# EAGLE design DIY_tool_-_Arduino_nano_shield_v1.1 (EAGLE 8.0.0)
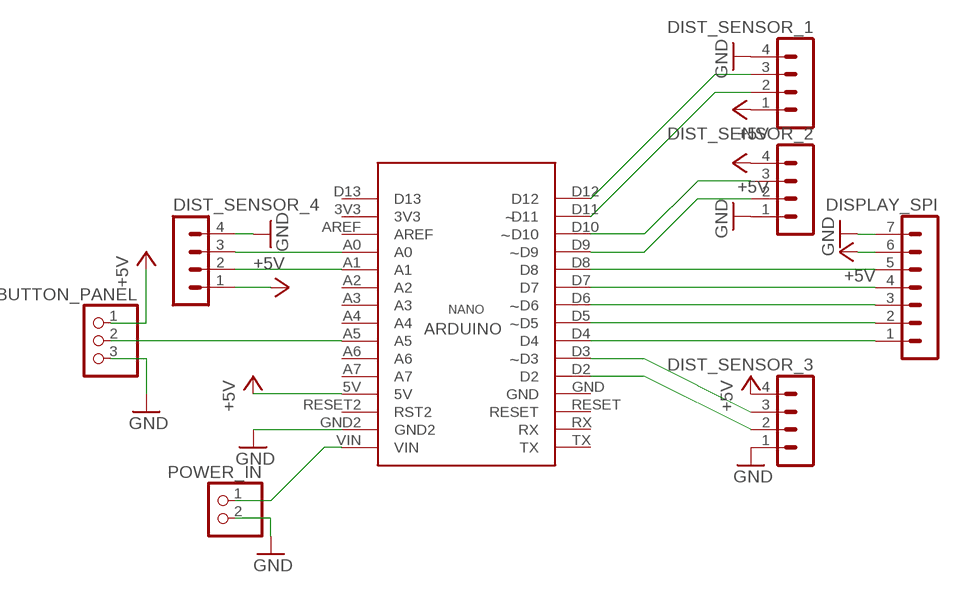
[diagram p0: schematic, sheet 1]

## Parts
BUTTON_PANEL  PINHD-1X3  [1X03]
DISPLAY_SPI  MA07-1  [MA07-1]
DIST_SENSOR_1  MA04-1  [MA04-1]
DIST_SENSOR_2  MA04-1  [MA04-1]
DIST_SENSOR_3  MA04-1  [MA04-1]
DIST_SENSOR_4  MA04-1  [MA04-1]
POWER_IN  PINHD-1X2  [1X02]
U$2  NANO  [NANO]

## Nets
+5V: BUTTON_PANEL.1 DISPLAY_SPI.6 DIST_SENSOR_1.1 DIST_SENSOR_2.4 DIST_SENSOR_3.4 DIST_SENSOR_4.1 U$2.5V
BTN_IN: BUTTON_PANEL.2 U$2.A5
GND: BUTTON_PANEL.3 DISPLAY_SPI.7 DIST_SENSOR_1.4 DIST_SENSOR_2.1 DIST_SENSOR_3.1 DIST_SENSOR_4.4 POWER_IN.2 U$2.GND2
OLED_CS: DISPLAY_SPI.1 U$2.D4
OLED_D0: DISPLAY_SPI.5 U$2.D8
OLED_D1: DISPLAY_SPI.4 U$2.D7
OLED_DC: DISPLAY_SPI.2 U$2.D5
OLED_RST: DISPLAY_SPI.3 U$2.D6
POWER_IN: POWER_IN.1 U$2.VIN
SENSOR_1_A: DIST_SENSOR_1.3 U$2.D12
SENSOR_1_B: DIST_SENSOR_1.2 U$2.D11
SENSOR_2_A: DIST_SENSOR_2.3 U$2.D10
SENSOR_2_B: DIST_SENSOR_2.2 U$2.D9
SENSOR_3_A: DIST_SENSOR_3.3 U$2.D3
SENSOR_3_B: DIST_SENSOR_3.2 U$2.D2
SENSOR_4_A: DIST_SENSOR_4.3 U$2.A0
SENSOR_4_B: DIST_SENSOR_4.2 U$2.A1
Unconnected: U$2.3V3 U$2.A2 U$2.A3 U$2.A4 U$2.A6 U$2.A7 U$2.AREF U$2.D13 U$2.GND U$2.RESET U$2.RESET2(RST2) U$2.RX U$2.TX

## Library data of the parts
BUTTON_PANEL = pinhead:PINHD-1X3: PIN HEADER
DISPLAY_SPI = con-lstb:MA07-1: PIN HEADER; OC_FARNELL: unknown; OC_NEWARK: unknown
DIST_SENSOR_1-DIST_SENSOR_4 = con-lstb:MA04-1: PIN HEADER; OC_FARNELL: unknown; OC_NEWARK: unknown
POWER_IN = pinhead:PINHD-1X2: PIN HEADER
U$2 = NANO:NANO

## Board
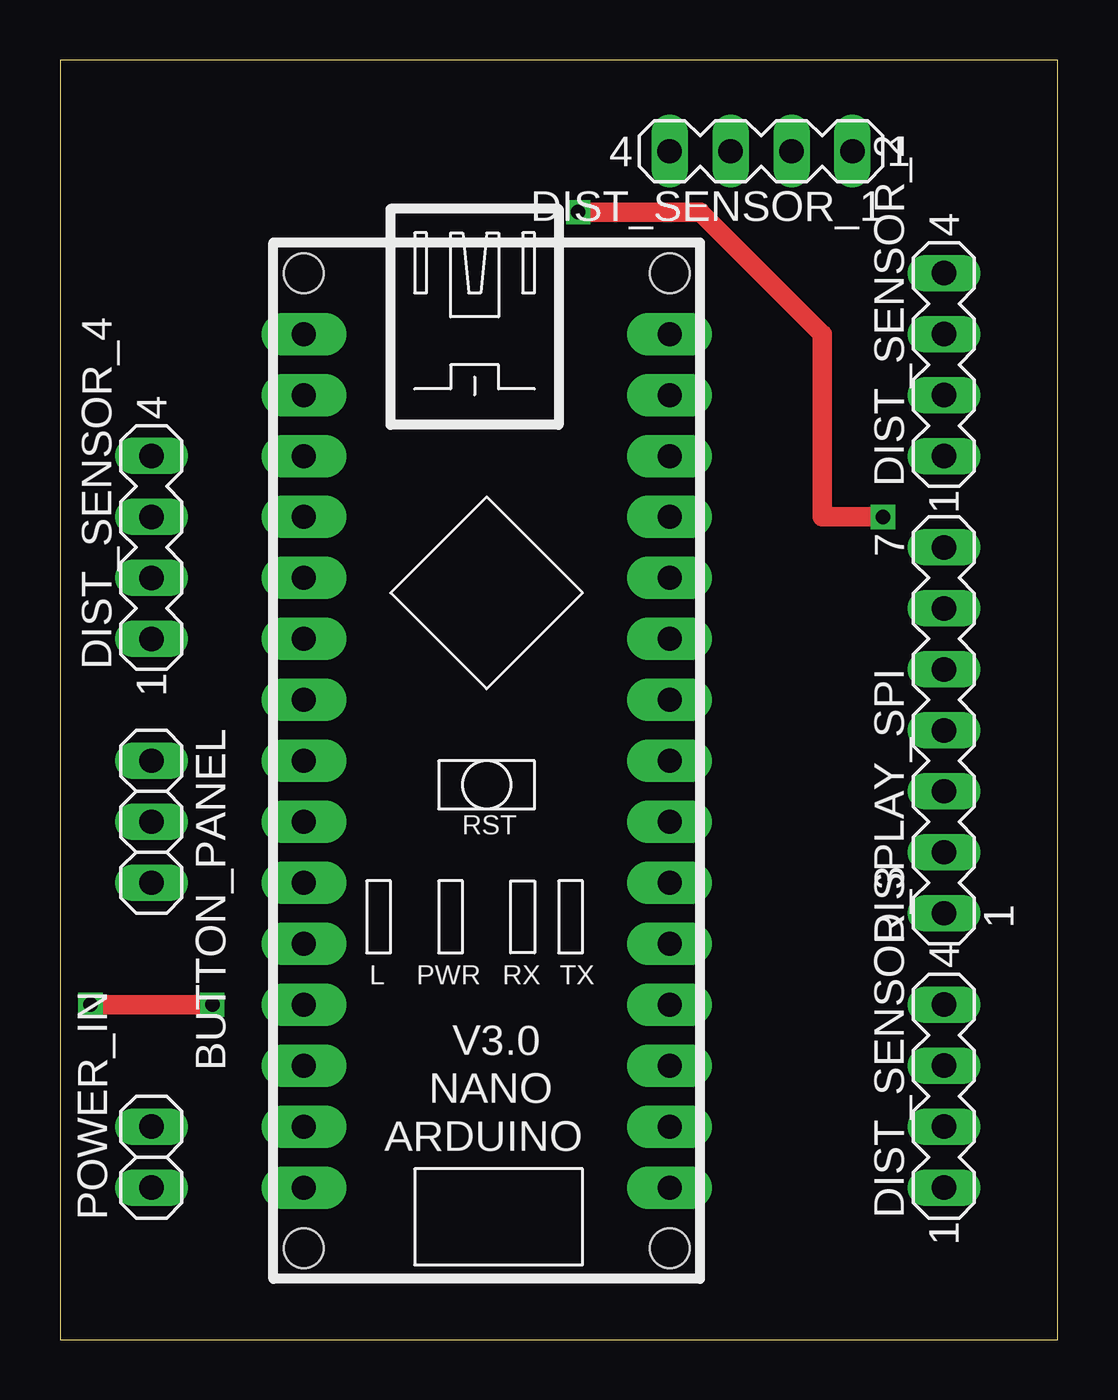
[diagram p1: board, top side]
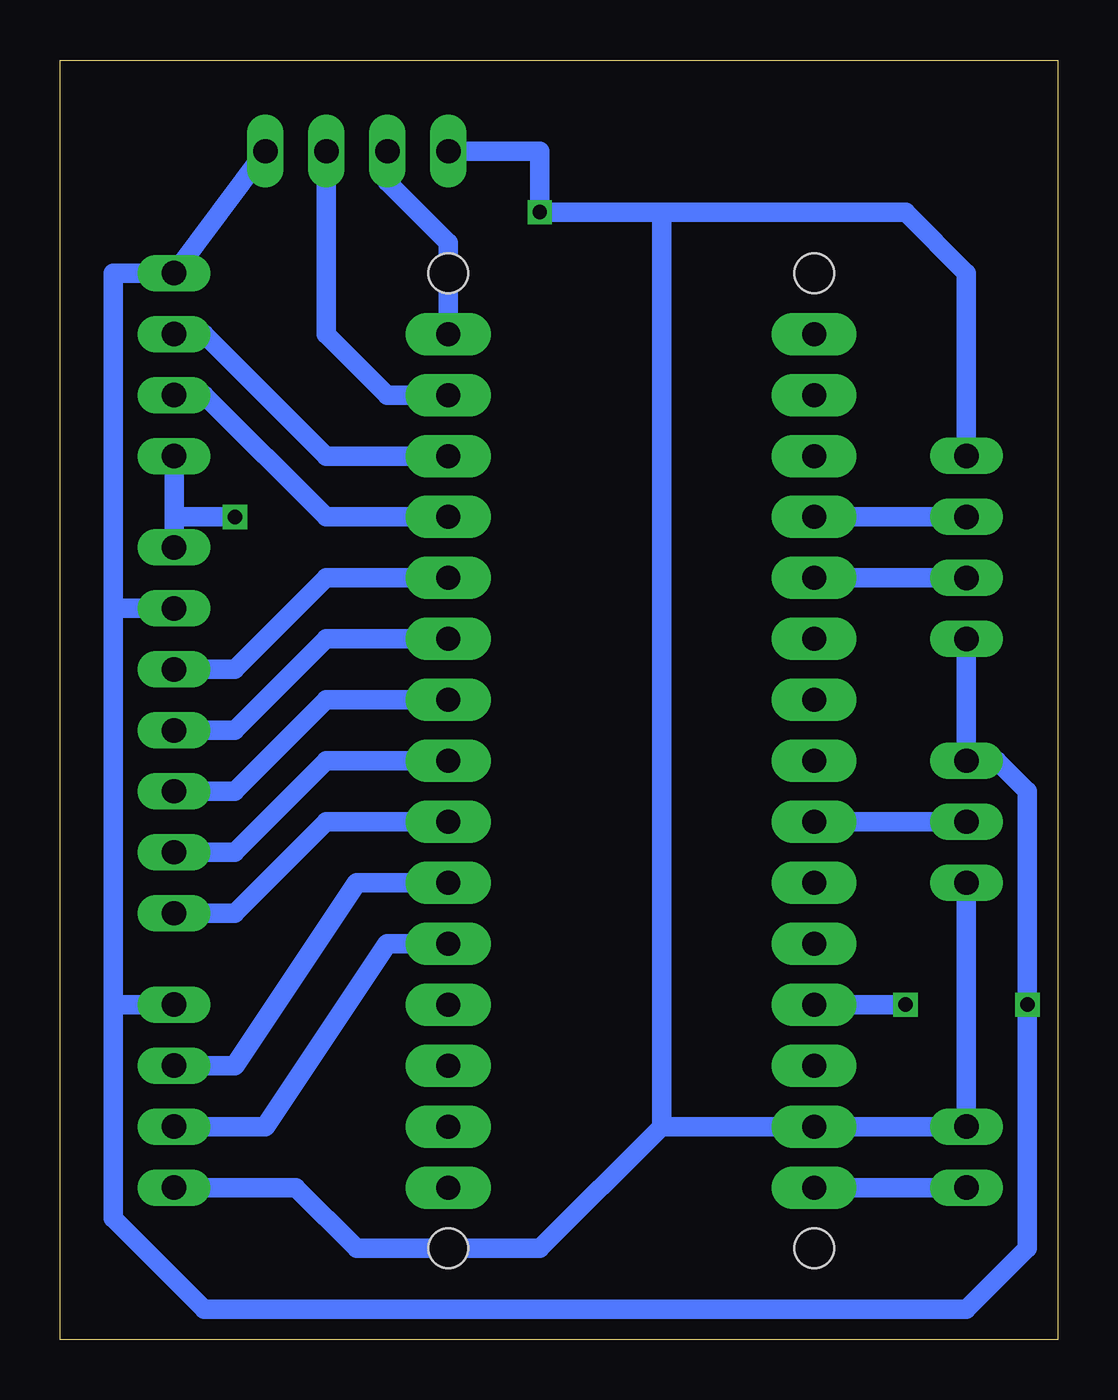
[diagram p2: board, bottom side, seen from below]

Size 41.58 x 53.33 mm. Coordinates in mm from the lower left corner, seen from the top.
Outline: 0,0 41.58,0 41.58,53.33 0,53.33 0,0
Copper layers (1*16): Top 0.035mm / dielectric 1.5mm / Bottom 0.035mm
Design rules "default": minimum track width 10mil, minimum drill 24mil, track to track 8mil, track to pad 8mil, pad to pad 8mil, via to via 8mil, smd to smd 8mil, copper to edge 40mil, drill to drill 8mil, minimum pad ring 10mil, minimum via ring 8mil, stop-mask expansion 4mil, vias tented up to drill 0mil, thermal gap 10mil

### Footprints (pad centres in the part's own frame; a part is rotated, then mirrored left to right if it is on the bottom)
1X03 = drill 1.016 long: 1 -2.54,0; 2 0,0; 3 2.54,0
MA07-1 = drill 1.016 long: 1 -7.62,0; 2 -5.08,0; 3 -2.54,0; 4 0,0; 5 2.54,0; 6 5.08,0; 7 7.62,0
MA04-1 = drill 1.016 long: 1 -3.81,0; 2 -1.27,0; 3 1.27,0; 4 3.81,0
1X02 = drill 1.016 long: 1 -1.27,0; 2 1.27,0
NANO = drill 1 pad 1.778 long: 3V3 7.62,-15.24; 5V 7.62,10.16; A0 7.62,-10.16; A1 7.62,-7.62; A2 7.62,-5.08; A3 7.62,-2.54; A4 7.62,0; A5 7.62,2.54; A6 7.62,5.08; A7 7.62,7.62; AREF 7.62,-12.7; D2 -7.62,7.62; D3 -7.62,5.08; D4 -7.62,2.54; D5 -7.62,0; D6 -7.62,-2.54; D7 -7.62,-5.08; D8 -7.62,-7.62; D9 -7.62,-10.16; D10 -7.62,-12.7; D11 -7.62,-15.24; D12 -7.62,-17.78; D13 7.62,-17.78; GND -7.62,10.16; GND2 7.62,15.24; RESET -7.62,12.7; RESET2 7.62,12.7; RX -7.62,15.24; TX -7.62,17.78; VIN 7.62,17.78 | hole 1.651: -7.62,-20.32; 7.62,-20.32; -7.62,20.32; 7.62,20.32

### Placement (x,y rotation side)
BUTTON_PANEL  3.81,21.59 270 top
DISPLAY_SPI  36.83,25.4 90 top
DIST_SENSOR_1  29.21,49.53 180 top
DIST_SENSOR_2  36.83,40.64 90 top
DIST_SENSOR_3  36.83,10.16 90 top
DIST_SENSOR_4  3.81,33.02 90 top
POWER_IN  3.81,7.62 90 top
U$2  17.78,24.13 180 top

### Tracks (layer width: path | path; a pad name or v marks a point on that pad's centre or on a via)
+5V  (via drill 0.6)
  Top 0.813: v6.35,13.97 v1.27,13.97
  Bottom 0.813: U$2.5V v6.35,13.97 | DIST_SENSOR_1.1 DIST_SENSOR_2.4 39.37,44.45 39.37,30.48 | DISPLAY_SPI.6 39.37,30.48 | DIST_SENSOR_4.1 BUTTON_PANEL.1 2.54,24.13 1.27,22.86 v1.27,13.97 1.27,3.81 3.81,1.27 35.56,1.27 39.37,5.08 39.37,13.97 | 39.37,30.48 39.37,13.97 | 39.37,13.97 DIST_SENSOR_3.4
BTN_IN
  Bottom 0.813: BUTTON_PANEL.2 U$2.A5
GND  (via drill 0.6)
  Top 0.813: v21.59,46.99 26.67,46.99 31.75,41.91 31.75,34.29 v34.29,34.29
  Bottom 0.813: BUTTON_PANEL.3 POWER_IN.2 U$2.GND2 16.51,8.89 | DISPLAY_SPI.7 36.83,34.29 | DIST_SENSOR_2.1 36.83,34.29 | 36.83,34.29 v34.29,34.29 | DIST_SENSOR_1.4 21.59,49.53 v21.59,46.99 16.51,46.99 | DIST_SENSOR_4.4 3.81,44.45 6.35,46.99 16.51,46.99 | DIST_SENSOR_3.1 31.75,6.35 29.21,3.81 21.59,3.81 16.51,8.89 | 16.51,8.89 16.51,46.99
OLED_CS
  Bottom 0.813: DISPLAY_SPI.1 34.29,17.78 30.48,21.59 U$2.D4
OLED_D0
  Bottom 0.813: DISPLAY_SPI.5 34.29,27.94 30.48,31.75 U$2.D8
OLED_D1
  Bottom 0.813: U$2.D7 30.48,29.21 34.29,25.4 DISPLAY_SPI.4
OLED_DC
  Bottom 0.813: U$2.D5 30.48,24.13 34.29,20.32 DISPLAY_SPI.2
OLED_RST
  Bottom 0.813: DISPLAY_SPI.3 34.29,22.86 30.48,26.67 U$2.D6
POWER_IN
  Bottom 0.813: POWER_IN.1 U$2.VIN
SENSOR_1_A
  Bottom 0.813: U$2.D12 25.4,45.72 27.94,48.26 DIST_SENSOR_1.3
SENSOR_1_B
  Bottom 0.813: U$2.D11 27.94,39.37 30.48,41.91 DIST_SENSOR_1.2
SENSOR_2_A
  Bottom 0.813: U$2.D10 30.48,36.83 35.56,41.91 DIST_SENSOR_2.3
SENSOR_2_B
  Bottom 0.813: DIST_SENSOR_2.2 35.56,39.37 30.48,34.29 U$2.D9
SENSOR_3_A
  Bottom 0.813: DIST_SENSOR_3.3 34.29,11.43 29.21,19.05 U$2.D3
SENSOR_3_B
  Bottom 0.813: U$2.D2 27.94,16.51 33.02,8.89 DIST_SENSOR_3.2
SENSOR_4_A
  Bottom 0.813: U$2.A0 DIST_SENSOR_4.3
SENSOR_4_B
  Bottom 0.813: DIST_SENSOR_4.2 U$2.A1